# Altium project Light Sensor Prototype.PrjPcb
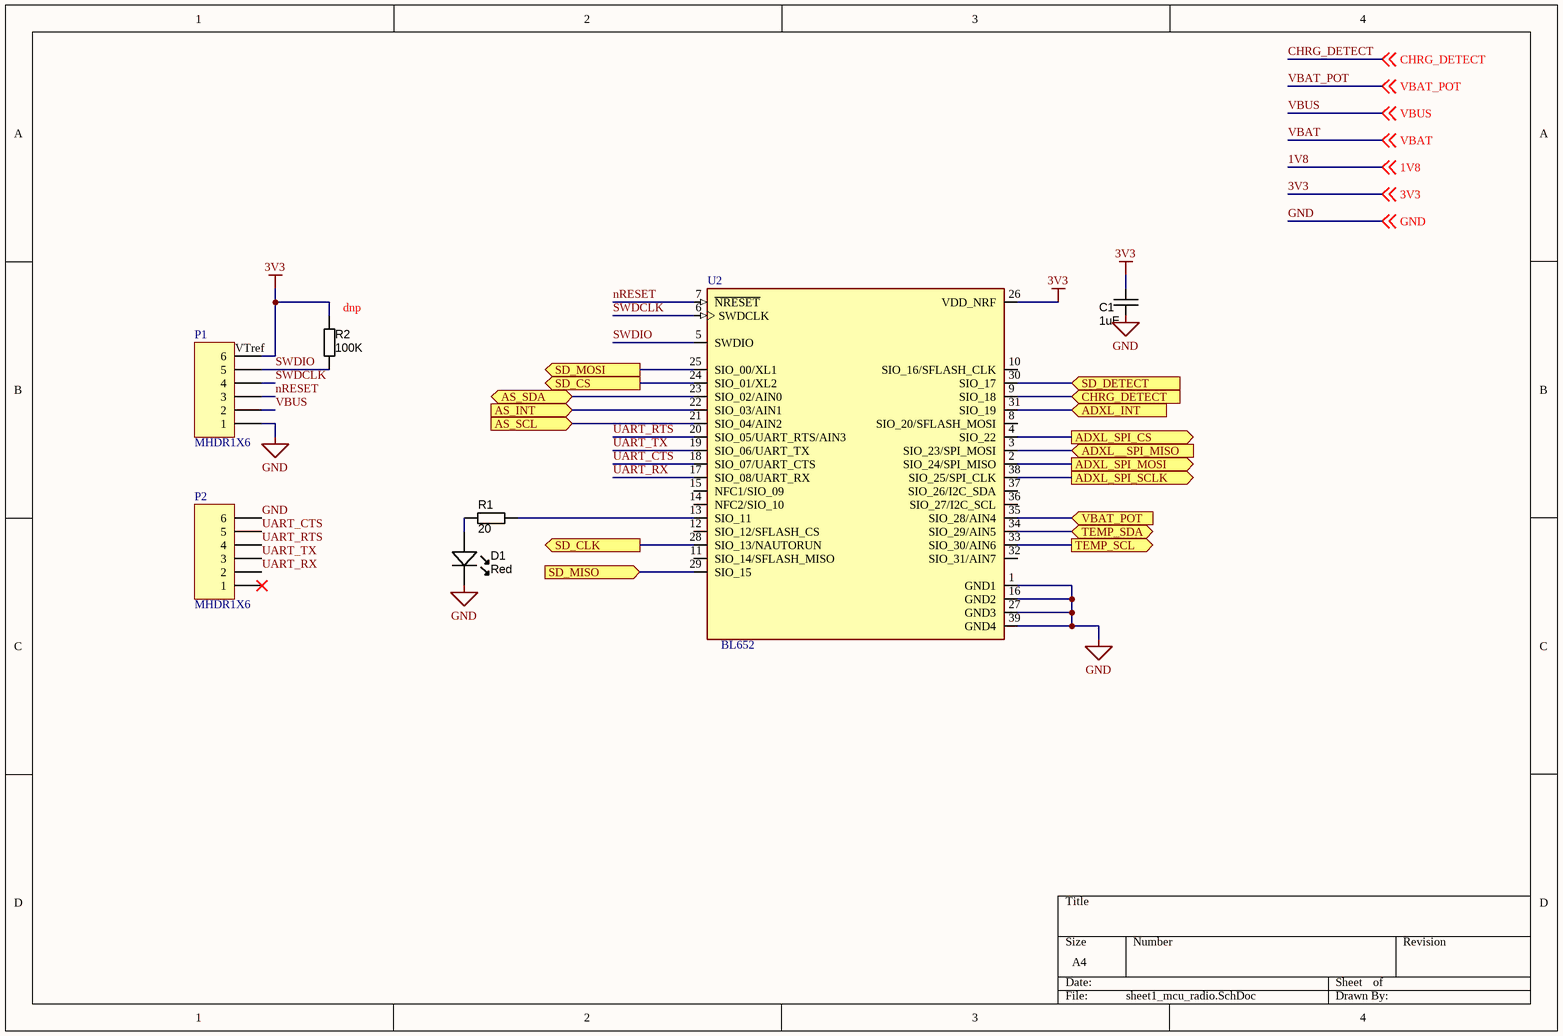
[diagram p0: sheet1_mcu_radio.SchDoc]
4 sheets, 41 parts. Net scope: flat (ports and power ports of the same name join across sheets).
Board file: Light Sensor Prototype.PcbDoc
Sheets:
  sheet1_mcu_radio.SchDoc
  sheet2_sensors.SchDoc
  sheet3_memory.SchDoc
  sheet4_power.SchDoc

## Sheet sheet1_mcu_radio.SchDoc
size A4

### Parts
C1  value 1uF  [CAPC1608X90N]  (hidden comment: approved sub OK)
D1  Red  [LED-0603-RED]
P1  MHDR1X6  [MHDR1X6]
P2  MHDR1X6  [MHDR1X6]
R1  value 20  [RESC1005X40N]  (hidden comment: Thick Film)
R2  value 100K  [RESC1005X40N]  (hidden comment: Thick Film)
U2  BL652  [BL652]

### Ports
ADXL__SPI_MISO (in), ADXL_INT (in), ADXL_SPI_CS (out), ADXL_SPI_MOSI (out), ADXL_SPI_SCLK (out), AS_INT (in), AS_SCL (in), AS_SDA (bidir), CHRG_DETECT (in), SD_CLK (out), SD_CS (out), SD_DETECT (in), SD_MISO (in), SD_MOSI (out), TEMP_SCL (out), TEMP_SDA (bidir), VBAT_POT (in)

### Nets
3V3: C1.1 P1.6 R2.1 U2.26(VDD_NRF) ; off-sheet 3V3
GND: C1.2 D1.K P1.1 P2.6 U2.1(GND1) U2.16(GND2) U2.27(GND3) U2.39(GND4) ; off-sheet GND
VBUS: P1.2 ; off-sheet VBUS
ADXL_INT: U2.31(SIO_19) ; port ADXL_INT
ADXL_SPI_CS: U2.4(SIO_22) ; port ADXL_SPI_CS
ADXL_SPI_MISO: U2.3(SIO_23/SPI_MOSI) ; port ADXL__SPI_MISO
ADXL_SPI_MOSI: U2.2(SIO_24/SPI_MISO) ; port ADXL_SPI_MOSI
ADXL_SPI_SCLK: U2.38(SIO_25/SPI_CLK) ; port ADXL_SPI_SCLK
AS_INT: U2.22(SIO_03/AIN1) ; port AS_INT
AS_SCL: U2.21(SIO_04/AIN2) ; port AS_SCL
AS_SDA: U2.23(SIO_02/AIN0) ; port AS_SDA
CHRG_DETECT: off-sheet CHRG_DETECT
nRESET: P1.3 U2.7(~{NRESET})
SD_CLK: U2.28(SIO_13/NAUTORUN) ; port SD_CLK
SD_CS: U2.24(SIO_01/XL2) ; port SD_CS
SD_DETECT: U2.30(SIO_17) ; port SD_DETECT
SD_MISO: U2.29(SIO_15) ; port SD_MISO
SD_MOSI: U2.25(SIO_00/XL1) ; port SD_MOSI
SWDCLK: P1.4 U2.6(SWDCLK)
SWDIO: P1.5 R2.2 U2.5(SWDIO)
TEMP_SCL: U2.33(SIO_30/AIN6) ; port TEMP_SCL
TEMP_SDA: U2.34(SIO_29/AIN5) ; port TEMP_SDA
UART_CTS: P2.5 U2.18(SIO_07/UART_CTS)
UART_RTS: P2.4 U2.20(SIO_05/UART_RTS/AIN3)
UART_RX: P2.2 U2.17(SIO_08/UART_RX)
UART_TX: P2.3 U2.19(SIO_06/UART_TX)
VBAT_POT: off-sheet VBAT_POT
NetC9_1: U2.35(SIO_28/AIN4) ; port VBAT_POT
NetD1_A: D1.A R1.1
NetR1_2: R1.2 U2.13(SIO_11)
NetR11_2: U2.9(SIO_18) ; port CHRG_DETECT

Not connected (* = marked no-connect by the designer): P2 1*; U2 8(SIO_20/SFLASH_MOSI) 10(SIO_16/SFLASH_CLK) 11(SIO_14/SFLASH_MISO) 12(SIO_12/SFLASH_CS) 14(NFC2/SIO_10) 15(NFC1/SIO_09) 32(SIO_31/AIN7) 36(SIO_27/I2C_SCL) 37(SIO_26/I2C_SDA)

### Notes on the sheet
- (near R2) dnp
- (near P1) VTref

### Library data of the parts
C1 = CAPC_100n_0603_X7R_50V_10%: Capacitor SMD Cer 10uF 10% 16V X5R 0603; Manufacturer: TDK; Manufacturer Part Number: C1608X5R1C106M080AB; Ratings: 16V; X5R; Material: ceramic; Package / Case: 0603 (1608 Metric); Tolerance: ±10%; Supplier: Farnell; Supplier Part Number: 2525096; Supplier Link: https://uk.farnell.com/tdk/c1608x5r1c106m080ab/cap-10-f-16v-20-x5r-0603/dp/2525096?st=2521959
D1 = LED_SMD_Red_0603_220mcd: Dialight 598-8E40-107F; Manufacturer 1: Kingbright Company LLC; Manufacturer Part Number 1: APT1608SURCK; Material: AlGaInP on GaAs; Ratings: 220 mcd; 630 nm; Voltage - Forward (Vf) Typ: 1.95V; Voltage - Forward (Vf) @ 10mA: 1.9V; SCDType: source; Package / Case: 0603 (1608 metric); Supplier 1: Digi-Key; Supplier Part Number 1: 754-1123-1-ND; ComponentLink1URL: http://www.us.kingbright.com/images/catalog/SPEC/APT1608SURCK.pdf; ComponentLink1Description: http://www.us.kingbright.com/images/catalog/SPEC/APT1608SURCK.pdf
P1 P2 = MHDR1X6: Header, 6-Pin; LatestRevisionDate: 17-Jul-2002; LatestRevisionNote: Re-released for DXP Platform.; Publisher: Altium Limited
R1 R2 = RES_100K_0402_5%: Resistor SMD chip 100k Ohm 0.063W 5% 0402; Manufacturer 1: Vishay Dale; Manufacturer Part Number 1: CRCW0402100KJNED; Ratings: 1/16 W; SCDType: undef; Package / Case: 0402 (1005 Metric); Tolerance: ±5%; ComponentLink2URL: http://www.yageo.com/documents/recent/PYu-RC0402_51_RoHS_L_6.pdf; ComponentLink2Description: http://www.yageo.com/documents/recent/PYu-RC0402_51_RoHS_L_6.pdf; Supplier 1: Digi-Key; Supplier Part Number 1: 541-100KJCT-ND; ComponentLink1URL: http://www.vishay.com/doc?20035; ComponentLink1Description: http://www.vishay.com/doc?20035; Supplier 2: Digi-Key; Supplier Part Number 2: 311-100KJRCT-ND; Manufacturer 2: Yageo; Manufacturer Part Number 2: RC0402JR-07100KL

## Sheet sheet2_sensors.SchDoc
size A4
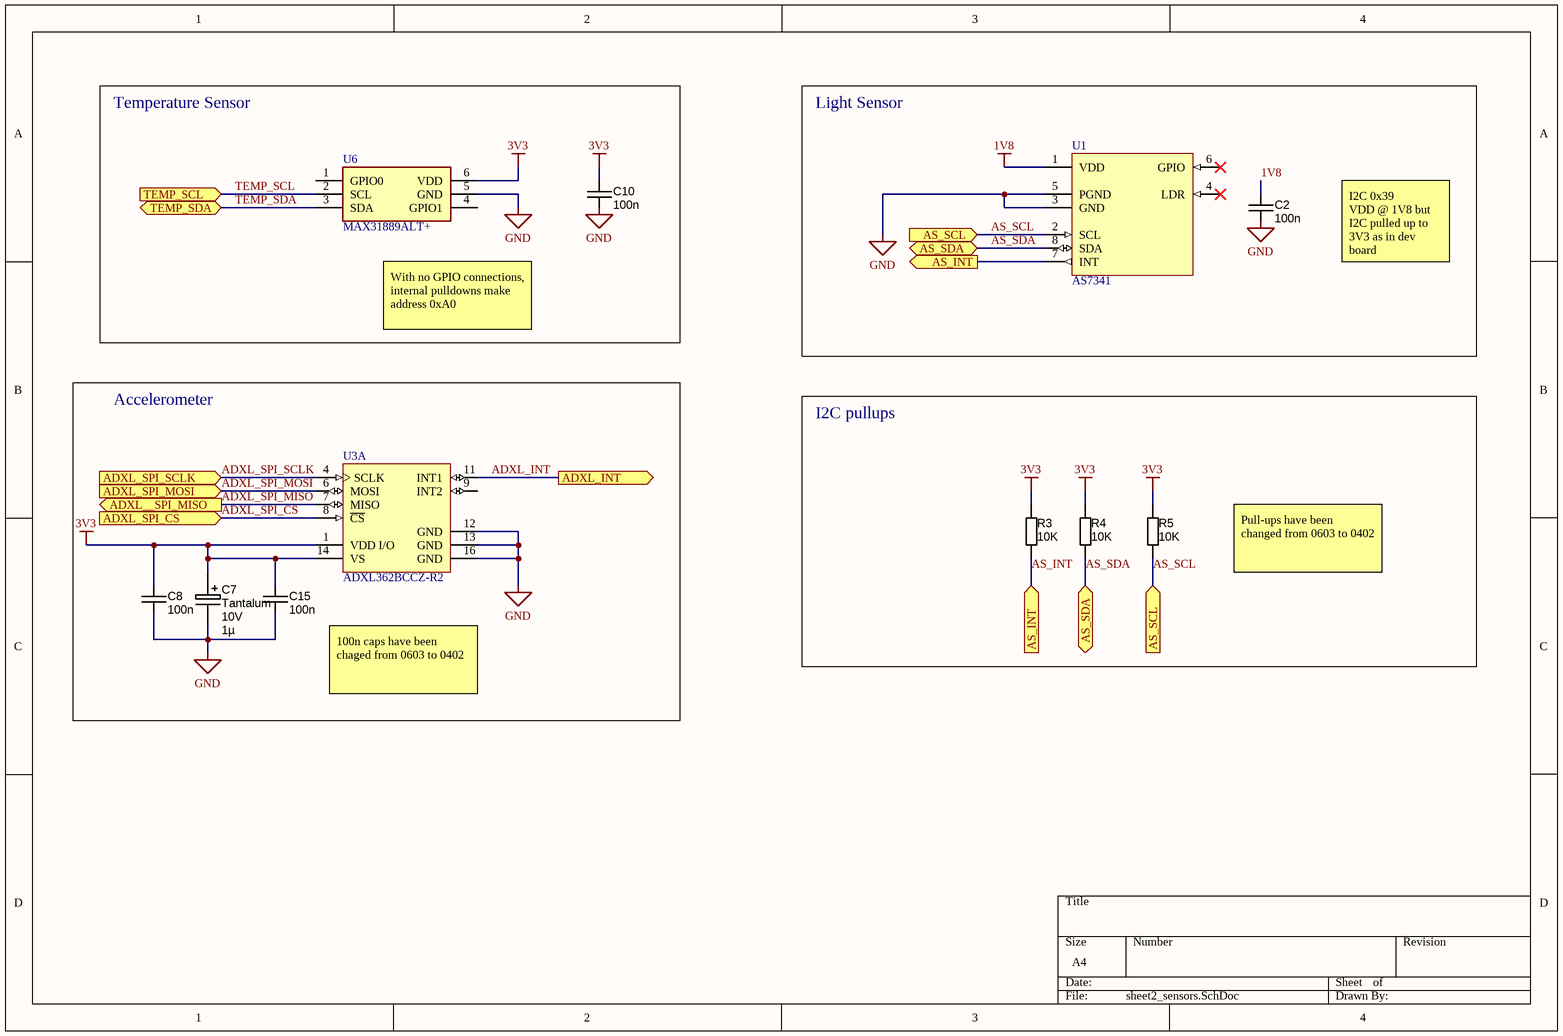
[diagram p1: sheet2_sensors.SchDoc]

### Parts
C2  100n  [CAPC1005X55N]
C7  Material: Tantalum  Ratings: 10V  [CAPMP2012X150USR]  (hidden comment: 1µ)
C8  100n  [CAPC1005X55N]
C10  100n  [CAPC1005X55N]
C15  100n  [CAPC1005X55N]
R3  value 10K  [RESC1005X40N]  (hidden comment: Thick Film)
R4  value 10K  [RESC1005X40N]  (hidden comment: Thick Film)
R5  value 10K  [RESC1005X40N]  (hidden comment: Thick Film)
U1  AS7341  [OLGA8]
U3  ADXL362BCCZ-R2  [ADI-CC-16-4_N]  (part A of 2)
U6  MAX31889ALT+  [MAX31889ALT]

### Blocks framed on the sheet
Temperature Sensor: C10 U6
Light Sensor: C2 U1
Accelerometer: C7 C8 C15 U3
I2C pullups: R3-R5

### Ports
ADXL__SPI_MISO (out), ADXL_INT (out), ADXL_SPI_CS (in), ADXL_SPI_MOSI (in), ADXL_SPI_SCLK (in), AS_INT (in), AS_INT (out), AS_SCL (in), AS_SDA (bidir), TEMP_SCL (in), TEMP_SDA (bidir)

### Nets
1V8: C2.1 U1.1(VDD)
3V3: C7.1 C8.1 C10.1 C15.1 R3.1 R4.1 R5.1 U3.1(VDD_I/O) U3.14(VS) U6.6(VDD)
GND: C2.2 C7.2 C8.2 C10.2 C15.2 U1.3(GND) U1.5(PGND) U3.12(GND) U3.13(GND) U3.16(GND) U6.5(GND)
ADXL_INT: U3.11(INT1) ; port ADXL_INT
ADXL_SPI_CS: U3.8(~{CS}) ; port ADXL_SPI_CS
ADXL_SPI_MISO: U3.7(MISO) ; port ADXL__SPI_MISO
ADXL_SPI_MOSI: U3.6(MOSI) ; port ADXL_SPI_MOSI
ADXL_SPI_SCLK: U3.4(SCLK) ; port ADXL_SPI_SCLK
AS_INT: R3.2 U1.7(INT) ; port AS_INT
AS_SCL: R5.2 U1.2(SCL) ; port AS_SCL
AS_SDA: R4.2 U1.8(SDA) ; port AS_SDA
TEMP_SCL: U6.2(SCL) ; port TEMP_SCL
TEMP_SDA: U6.3(SDA) ; port TEMP_SDA

Not connected (* = marked no-connect by the designer): U1 4(LDR)* 6(GPIO)*; U3 9(INT2); U6 1(GPIO0) 4(GPIO1)

### Notes on the sheet
- I2C 0x39
  VDD @ 1V8 but I2C pulled up to 3V3 as in dev board
- With no GPIO connections, internal pulldowns make address 0xA0
- Pull-ups have been changed from 0603 to 0402
- 100n caps have been chaged from 0603 to 0402

### Library data of the parts
C2 C8 C10 C15 = CAPC_100n_0402_X5R_16V_10%: Capacitor SMD Cer 100nF 10% 16V X5R 0402; Manufacturer 1: AVX Corporation; Manufacturer Part Number 1: 0402YD104KAT2A; Ratings: 16V; X5R; SCDType: spec; Tolerance: ±10%; Operating Temperature: -55°C ~ 125°C; Package / Case: 0402 (1005 Metric); Size / Dimension: 0.039" L x 0.020" W (1.00mm x 0.50mm); Supplier 1: Digi-Key; Supplier Part Number 1: 478-1126-1-ND; ComponentLink1URL: http://www.avx.com/docs/Catalogs/cx5r.pdf; ComponentLink1Description: http://www.avx.com/docs/Catalogs/cx5r.pdf; Supplier 2: Digi-Key; Supplier Part Number 2: 311-1347-1-ND; Manufacturer 2: Yageo; Manufacturer Part Number 2: CC0402KRX5R7BB104; ComponentLink2URL: http://www.yageo.com/documents/recent/UPY-GPHC_X5R_4V-to-50V_12.pdf; ComponentLink2Description: http://www.yageo.com/documents/recent/UPY-GPHC_X5R_4V-to-50V_12.pdf; Value: 100n
C7 = CAPT_1u_0805_10V: Capacitor SMD Tantalum 1uF 20% 10V 0805; Manufacturer 1: AVX Corporation; Manufacturer Part Number 1: TAJP106M010RNJ; Manufacturer Size Code: P; ESR (Equivalent Series Resistance): 6.000 Ohm; Type: Molded; SCDType: spec; Package / Case: 0805 (2012 metric); Tolerance: ±20%; Supplier 1: Digi-Key; Supplier Part Number 1: 478-3281-1-ND; Operating Temperature: -55°C ~ 125°C; Size / Dimension: 0.081" L x 0.053" W (2.05mm x 1.35mm); Height - Seated (Max): 0.059" (1.50mm); ComponentLink1URL: http://www.avx.com/docs/Catalogs/tajlp.pdf; ComponentLink1Description: http://www.avx.com/docs/Catalogs/tajlp.pdf; Value: 1µ
R3-R5 = RES_10K_0402_5%: Resistor SMD chip 10k Ohm 0.063W 5% 0402; Manufacturer 1: Vishay Dale; Manufacturer Part Number 1: CRCW040210K0FKED; Ratings: 1/16 W; SCDType: undef; Package / Case: 0402 (1005 Metric); Tolerance: ±5%; Manufacturer 2: Yageo; Manufacturer Part Number 2: RC0402JR-0710KL; Supplier 1: Digi-Key; Supplier Part Number 1: 541-10.0KLCT-ND; ComponentLink1URL: http://www.vishay.com/doc?20035; ComponentLink1Description: http://www.vishay.com/doc?20035; Supplier 2: Digi-Key; Supplier Part Number 2: 311-10KJRCT-ND; ComponentLink2URL: http://www.yageo.com/documents/recent/PYu-RC0402_51_RoHS_L_6.pdf; ComponentLink2Description: http://www.yageo.com/documents/recent/PYu-RC0402_51_RoHS_L_6.pdf
U1 = AS7341: AMS AS7341 / 11-Channel Spectral Sensor Frontend
U3 = ADXL362BCCZ-R2: Micropower, 3-Axis, +/-2 g / +/-4 g / +/-8 g Digital Output MEMS Accelerometer with 200 Hz BW, Industrial, 16-pin LGA, Reel; Manufacturer: Analog Devices; # of Axes: 3; -3dB Bandwidth: 200 Hz; Sensitivity: 1/2/4 mg/LSB; Supply Current: 1.8 uA; Voltage Supply (V): 1.6 to 3.5; DatasheetVersion: Rev. B; PackageVersion: 10-23-2012-A, 10/2012; PackageReference: CC-16-4; PackageDescription: 16-Pin Land Grid Array, 3.25 x 3 mm Body, 0.5 mm Pitch; Supplier 1: Digi-Key; Supplier Part Number 1: ADXL362BCCZ-R2TR-ND; Supplier 2: Digi-Key; Supplier Part Number 2: ADXL362BCCZ-R2CT-ND; Supplier 3: Digi-Key; Supplier Part Number 3: ADXL362BCCZ-R2DKR-ND; Supplier 4: Newark; Supplier Part Number 4: 45W7058; Supplier 5: Mouser; Supplier Part Number 5: 584-ADXL362BCCZ-R2; Output Type: Digital; Packing: Reel; Mounting Technology: Surface Mount; PartNumber: ADXL362BCCZ-R2; ComponentLink1Description: Manufacturer URL; ComponentLink1URL: http://www.analog.com/en/index.html; ComponentLink2Description: Datasheet; ComponentLink2URL: http://www.analog.com/static/imported-files/data_sheets/ADXL362.pdf; ComponentLink3Description: Package Specification; ComponentLink3URL: http:/www.analog.com/static/imported-files/packages/PKG_PDF/LGA(CC)/CC_16_4.pdf; ComponentLink4Description: Product URL; ComponentLink4URL: http://www.analog.com/en/mems-sensors/mems-inertial-sensors/adxl362/products/product.html
U6 = MAX31889ALT+: Integrated Circuit; Manufacturer_Name: Maxim Integrated; Datasheet Link: https://pdfserv.maximintegrated.com/en/ds/MAX31889.pdf; Height: 0.8mm; Manufacturer_Part_Number: MAX31889ALT+

## Sheet sheet3_memory.SchDoc
size A4
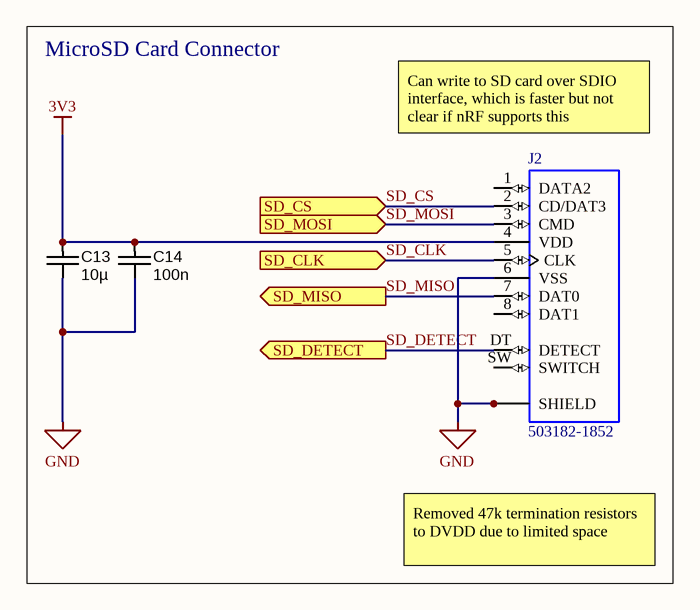
[diagram p2: sheet3_memory.SchDoc]

### Parts
C13  value 10µ  [CAPC2012X135N]  (hidden comment: approved sub OK)
C14  100n  [CAPC1005X55N]
J2  503182-1852  [MOLEX_503182-1852]

### Blocks framed on the sheet
MicroSD Card Connector: C13 C14 J2

### Ports
SD_CLK (in), SD_CS (in), SD_DETECT (out), SD_MISO (out), SD_MOSI (in)

### Nets
3V3: C13.1 C14.1 J2.4(VDD)
GND: C13.2 C14.2 J2.6(VSS) J2.P1(SHIELD) J2.P2(SHIELD) J2.P3(SHIELD) J2.P4(SHIELD) J2.P5(SHIELD)
SD_CLK: J2.5(CLK) ; port SD_CLK
SD_CS: J2.2(CD/DAT3) ; port SD_CS
SD_DETECT: J2.DT(DETECT) ; port SD_DETECT
SD_MISO: J2.7(DAT0) ; port SD_MISO
SD_MOSI: J2.3(CMD) ; port SD_MOSI

Not connected (* = marked no-connect by the designer): J2 1(DATA2) 8(DAT1) SW(SWITCH)

### Notes on the sheet
- (near J2) Can write to SD card over SDIO interface, which is faster but not clear if nRF supports this
- Removed 47k termination resistors to DVDD due to limited space

### Library data of the parts
C13 = CAPC_10u_0805_10V: Capacitor SMD Cer 10uF 10% 10V X5R 0805; Manufacturer 1: AVX Corporation; Manufacturer Part Number 1: 0805ZD106KAT2A; Ratings: 10V; X5R; Material: ceramic; SCDType: spec; Package / Case: 0805 (2012 metric); Tolerance: ±10%; Manufacturer 2: Kemet; Manufacturer Part Number 2: C0805C106K8PACTU; Supplier 1: Digi-Key; Supplier Part Number 1: 478-5167-1-ND; ComponentLink1URL: http://www.avx.com/docs/Catalogs/cx5r.pdf; ComponentLink1Description: http://www.avx.com/docs/Catalogs/cx5r.pdf; ComponentLink2URL: http://www.kemet.com/datasheets&C0805C106K8PACTU; ComponentLink2Description: http://www.kemet.com/datasheets&C0805C106K8PACTU; Supplier 2: Digi-Key; Supplier Part Number 2: 399-4925-1-ND
C14 = CAPC_100n_0402_X5R_16V_10%: as C2 on sheet sheet2_sensors; Tolerance: ±10%; Operating Temperature: -55°C ~ 125°C; Package / Case: 0402 (1005 Metric); Size / Dimension: 0.039" L x 0.020" W (1.00mm x 0.50mm); Supplier 1: Digi-Key; Supplier Part Number 1: 478-1126-1-ND; ComponentLink1URL: http://www.avx.com/docs/Catalogs/cx5r.pdf; ComponentLink1Description: http://www.avx.com/docs/Catalogs/cx5r.pdf; Supplier 2: Digi-Key; Supplier Part Number 2: 311-1347-1-ND; Manufacturer 2: Yageo; Manufacturer Part Number 2: CC0402KRX5R7BB104; ComponentLink2URL: http://www.yageo.com/documents/recent/UPY-GPHC_X5R_4V-to-50V_12.pdf; ComponentLink2Description: http://www.yageo.com/documents/recent/UPY-GPHC_X5R_4V-to-50V_12.pdf; Value: 100n
J2 = 503182-1852: 10 _8 + 2_ Position Card Connector microSDâ„¢ Surface Mount, Right Angle Gold; MF: Molex; MP: 5031821852; Digi-Key_Part_Number: WM12834CT-ND; Digi-Key_Purchase_URL: https://www.digikey.com.tr/product-detail/en/molex/5031821852/WM12834CT-ND/5823232?utm_source=snapeda&utm_medium=aggregator&utm_campaign=symbol; SnapEDA_Link: https://www.snapeda.com/parts/5031821852/Molex/view-part/46835/?ref=snap; Value: *; Package: None

## Sheet sheet4_power.SchDoc
size A4
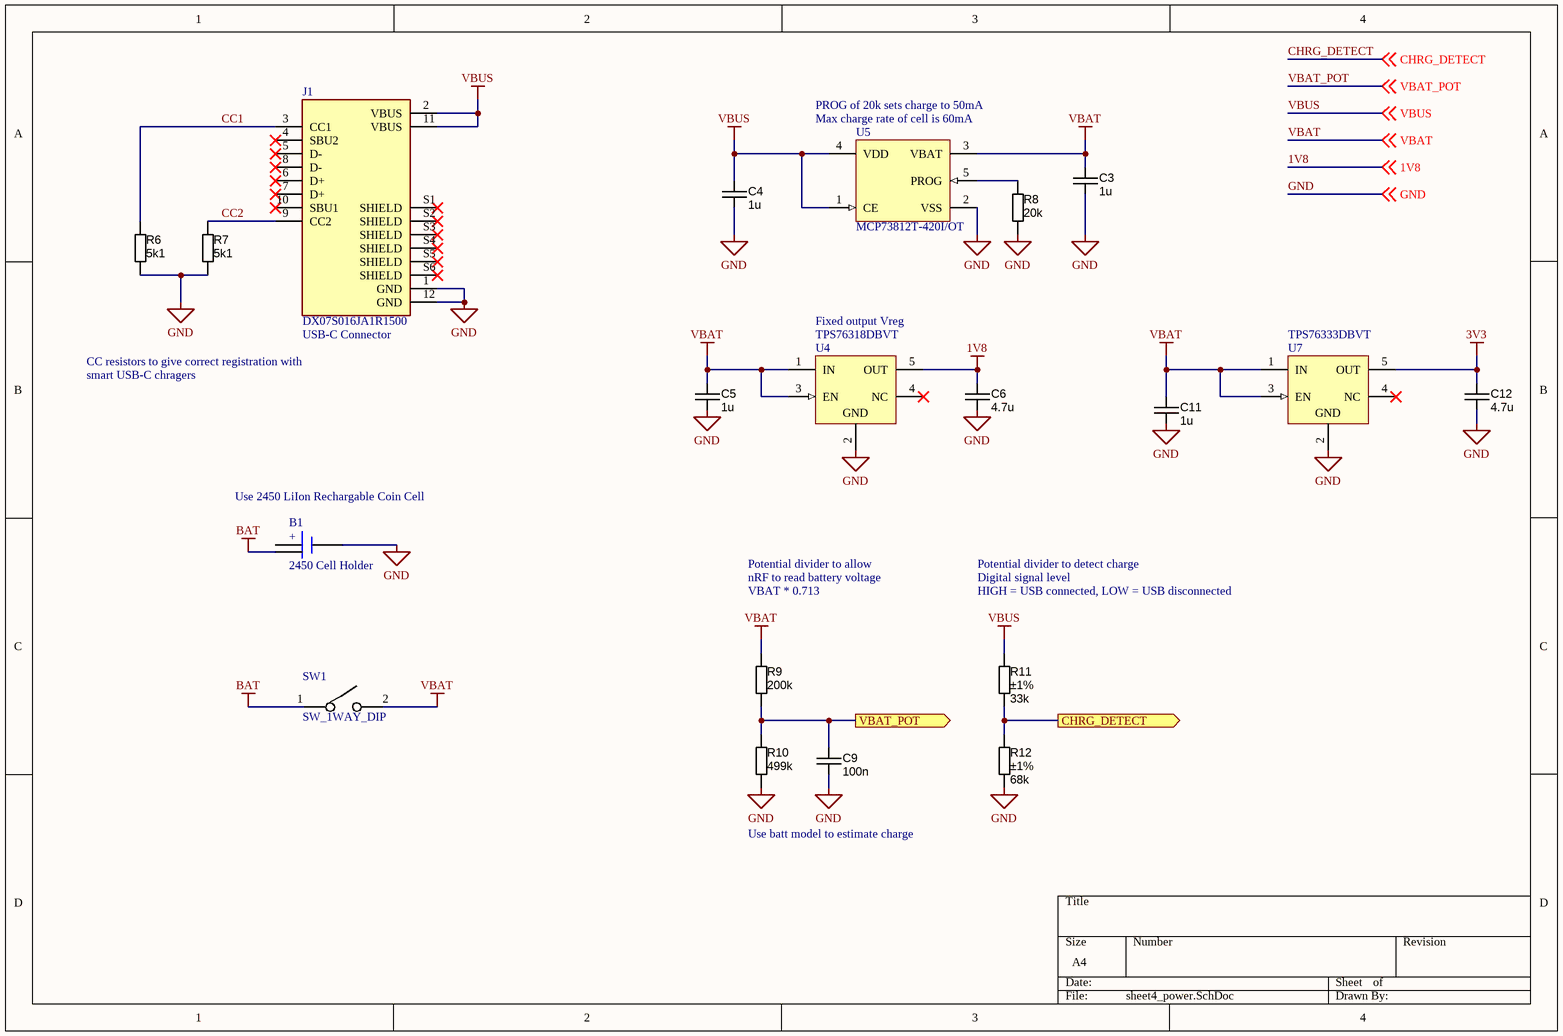
[diagram p3: sheet4_power.SchDoc]

### Parts
B1  2450 Cell Holder  [BC-2404]
C3  1u  [CAPC1005X55N]
C4  1u  [CAPC1005X55N]
C5  1u  [CAPC1005X55N]
C6  4.7u  [CAPC1005X55N]
C9  100n  [CAPC1005X55N]
C11  1u  [CAPC1005X55N]
C12  4.7u  [CAPC1005X55N]
J1  DX07S016JA1R1500  [JAE_DX07S016JA1R1500]
R6  value 5k1  [RESC1005X40N]  (hidden comment: Thick Film)
R7  value 5k1  [RESC1005X40N]  (hidden comment: Thick Film)
R8  value 20k  [RESC1005X40N]  (hidden comment: Thick Film)
R9  value 200k  [RESC1005X40N]  (hidden comment: Thick Film)
R10  value 499k  [RESC1005X40N]  (hidden comment: Thick Film)
R11  value 33k  Tolerance: ±1%  [RESC1608X55N]  (hidden comment: Thick Film)
R12  value 68k  Tolerance: ±1%  [RESC1608X55N]  (hidden comment: Thick Film)
SW1  SW_1WAY_DIP  [SW_1WAY]
U4  TPS76318DBVT  [TI-DBV5_N]
U5  MCP73812T-420I/OT  [SOT-23-OT5_N]
U7  TPS76333DBVT  [TI-DBV5_N]

### Ports
CHRG_DETECT (out), VBAT_POT (out)

### Nets
1V8: C6.1 U4.5(OUT) ; off-sheet 1V8
3V3: C12.1 U7.5(OUT)
BAT: B1.3(+) SW1.1
GND: B1.2(-) C3.2 C4.2 C5.2 C6.2 C9.2 C11.2 C12.2 J1.1(GND) J1.12(GND) R6.2 R7.2 R8.2 R10.2 R12.2 U4.2(GND) U5.2(VSS) U7.2(GND) ; off-sheet GND
VBAT: C3.1 C5.1 C11.1 R9.1 SW1.2 U4.1(IN) U4.3(EN) U5.3(VBAT) U7.1(IN) U7.3(EN) ; off-sheet VBAT
VBUS: C4.1 J1.2(VBUS) J1.11(VBUS) R11.1 U5.1(CE) U5.4(VDD) ; off-sheet VBUS
CC1: J1.3(CC1) R6.1
CC2: J1.9(CC2) R7.1
CHRG_DETECT: off-sheet CHRG_DETECT
VBAT_POT: off-sheet VBAT_POT
NetC9_1: C9.1 R9.2 R10.1 ; port VBAT_POT
NetR8_1: R8.1 U5.5(PROG)
NetR11_2: R11.2 R12.1 ; port CHRG_DETECT

Not connected (* = marked no-connect by the designer): B1 1(+); J1 4(SBU2)* 5(D-)* 6(D+)* 7(D+)* 8(D-)* 10(SBU1)* S1(SHIELD)* S2(SHIELD)* S3(SHIELD)* S4(SHIELD)* S5(SHIELD)* S6(SHIELD)*; U4 4(NC)*; U7 4(NC)*

### Notes on the sheet
- (near U5) PROG of 20k sets charge to 50mA
- (near U5) Max charge rate of cell is 60mA
- CC resistors to give correct registration with
- smart USB-C chragers
- (near J1) USB-C Connector
- (near U4) Fixed output Vreg
- (near B1) Use 2450 LiIon Rechargable Coin Cell
- Potential divider to allow
- nRF to read battery voltage
- Potential divider to detect charge
- Digital signal level
- VBAT * 0.713
- HIGH = USB connected, LOW = USB disconnected
- Use batt model to estimate charge

### Library data of the parts
B1 = 2450-LiIon: Multicomp BC-2404
C3-C5 C11 = CAPC_100n_0402_X5R_16V_10%: Capacitor SMD Cer 1uF 10% 16V X5R 0402; Manufacturer 1: AVX Corporation; Manufacturer Part Number 1: 0402YD104KAT2A; Ratings: 16V; X5R; SCDType: spec; Tolerance: ±10%; Operating Temperature: -55°C ~ 125°C; Package / Case: 0402 (1005 Metric); Size / Dimension: 0.039" L x 0.020" W (1.00mm x 0.50mm); Supplier 1: Digi-Key; Supplier Part Number 1: 478-1126-1-ND; ComponentLink1URL: http://www.avx.com/docs/Catalogs/cx5r.pdf; ComponentLink1Description: http://www.avx.com/docs/Catalogs/cx5r.pdf; Supplier 2: Digi-Key; Supplier Part Number 2: 311-1347-1-ND; Manufacturer 2: Yageo; Manufacturer Part Number 2: CC0402KRX5R7BB104; ComponentLink2URL: http://www.yageo.com/documents/recent/UPY-GPHC_X5R_4V-to-50V_12.pdf; ComponentLink2Description: http://www.yageo.com/documents/recent/UPY-GPHC_X5R_4V-to-50V_12.pdf; Value: 1u
C6 C12 = CAPC_100n_0402_X5R_16V_10%: Capacitor SMD Cer 4.7uF 10% 16V X5R 0402; Manufacturer 1: AVX Corporation; Manufacturer Part Number 1: 0402YD104KAT2A; Ratings: 16V; X5R; SCDType: spec; Tolerance: ±10%; Operating Temperature: -55°C ~ 125°C; Package / Case: 0402 (1005 Metric); Size / Dimension: 0.039" L x 0.020" W (1.00mm x 0.50mm); Supplier 1: Digi-Key; Supplier Part Number 1: 478-1126-1-ND; ComponentLink1URL: http://www.avx.com/docs/Catalogs/cx5r.pdf; ComponentLink1Description: http://www.avx.com/docs/Catalogs/cx5r.pdf; Supplier 2: Digi-Key; Supplier Part Number 2: 311-1347-1-ND; Manufacturer 2: Yageo; Manufacturer Part Number 2: CC0402KRX5R7BB104; ComponentLink2URL: http://www.yageo.com/documents/recent/UPY-GPHC_X5R_4V-to-50V_12.pdf; ComponentLink2Description: http://www.yageo.com/documents/recent/UPY-GPHC_X5R_4V-to-50V_12.pdf; Value: 4.7u
C9 = CAPC_100n_0402_X5R_16V_10%: as C2 on sheet sheet2_sensors; Tolerance: ±10%; Operating Temperature: -55°C ~ 125°C; Package / Case: 0402 (1005 Metric); Size / Dimension: 0.039" L x 0.020" W (1.00mm x 0.50mm); Supplier 1: Digi-Key; Supplier Part Number 1: 478-1126-1-ND; ComponentLink1URL: http://www.avx.com/docs/Catalogs/cx5r.pdf; ComponentLink1Description: http://www.avx.com/docs/Catalogs/cx5r.pdf; Supplier 2: Digi-Key; Supplier Part Number 2: 311-1347-1-ND; Manufacturer 2: Yageo; Manufacturer Part Number 2: CC0402KRX5R7BB104; ComponentLink2URL: http://www.yageo.com/documents/recent/UPY-GPHC_X5R_4V-to-50V_12.pdf; ComponentLink2Description: http://www.yageo.com/documents/recent/UPY-GPHC_X5R_4V-to-50V_12.pdf; Value: 100n
J1 = DX07S016JA1R1500: USB-C (USB TYPE-C) USB 2.0 Receptacle Connector 24 (16+8 Dummy) Position Surface Mount, Right Angle; Through Hole; MF: JAE Electronics; Value: *; Price: None; Package: None; Availability: Unavailable; MP: DX07S016JA1R1500; DigiKey-Purchase-URL: https://snapeda.com/shop?store=DigiKey&id=4551013; SnapEDA_Link: https://www.snapeda.com/parts/DX07S016JA1R1500/JAE%20Electronics/view-part/4551013/?ref=snap
R6 R7 = RES_3K3_0402_5%: Resistor SMD chip 5.1k Ohm 0.063W 5% 0402; Manufacturer 1: Yageo; Manufacturer Part Number 1: RC0402JR-073K3L; Ratings: 1/16 W; SCDType: spec; Package / Case: 0402 (1005 metric); Tolerance: ±5%; Material: Thick Film; Supplier 1: Digi-Key; Supplier Part Number 1: 311-3.3KJRCT-ND; ComponentLink1URL: http://www.yageo.com/documents/recent/PYu-RC0402_51_RoHS_L_6.pdf; ComponentLink1Description: http://www.yageo.com/documents/recent/PYu-RC0402_51_RoHS_L_6.pdf
R8 = RES_3K3_0402_5%: Resistor SMD chip 20k Ohm 0.063W 5% 0402; Manufacturer 1: Yageo; Manufacturer Part Number 1: RC0402JR-073K3L; Ratings: 1/16 W; SCDType: spec; Package / Case: 0402 (1005 metric); Tolerance: ±5%; Material: Thick Film; Supplier 1: Digi-Key; Supplier Part Number 1: 311-3.3KJRCT-ND; ComponentLink1URL: http://www.yageo.com/documents/recent/PYu-RC0402_51_RoHS_L_6.pdf; ComponentLink1Description: http://www.yageo.com/documents/recent/PYu-RC0402_51_RoHS_L_6.pdf
R9 = RES_3K3_0402_5%: Resistor SMD chip 2.4 MOhm 0.063W 5% 0402; Manufacturer 1: Yageo; Manufacturer Part Number 1: RC0402JR-073K3L; Ratings: 1/16 W; SCDType: spec; Package / Case: 0402 (1005 metric); Tolerance: ±5%; Material: Thick Film; Supplier 1: Digi-Key; Supplier Part Number 1: 311-3.3KJRCT-ND; ComponentLink1URL: http://www.yageo.com/documents/recent/PYu-RC0402_51_RoHS_L_6.pdf; ComponentLink1Description: http://www.yageo.com/documents/recent/PYu-RC0402_51_RoHS_L_6.pdf
R10 = RES_3K3_0402_5%: Resistor SMD chip 7.5 MOhm 0.063W 5% 0402; Manufacturer 1: Yageo; Manufacturer Part Number 1: RC0402JR-073K3L; Ratings: 1/16 W; SCDType: spec; Package / Case: 0402 (1005 metric); Tolerance: ±5%; Material: Thick Film; Supplier 1: Digi-Key; Supplier Part Number 1: 311-3.3KJRCT-ND; ComponentLink1URL: http://www.yageo.com/documents/recent/PYu-RC0402_51_RoHS_L_6.pdf; ComponentLink1Description: http://www.yageo.com/documents/recent/PYu-RC0402_51_RoHS_L_6.pdf
R11 = RES_10K_0603_1%: Resistor SMD chip 33k Ohm 0.1W 1% 0603; Manufacturer 1: Yageo; Manufacturer Part Number 1: RC0603FR-0710KL; Ratings: 1/10W; SCDType: spec; Package / Case: 0603 (1608 Metric); Supplier 1: Digi-Key; Supplier Part Number 1: 311-10.0KHRCT-ND
R12 = RES_10K_0603_1%: Resistor SMD chip 68k Ohm 0.1W 1% 0603; Manufacturer 1: Yageo; Manufacturer Part Number 1: RC0603FR-0710KL; Ratings: 1/10W; SCDType: spec; Package / Case: 0603 (1608 Metric); Supplier 1: Digi-Key; Supplier Part Number 1: 311-10.0KHRCT-ND
U4 = TPS76318DBVT: Single Output LDO, 150 mA, Fixed 1.8 V Output, 2.7 to 10 V Input, with Low IQ, 5-pin SOT-23 (DBV), -40 to 125 degC, Green (RoHS & no Sb/Br); Manufacturer: Texas Instruments; Accuracy(%): 3; Fixed Output Options(V): 1.8; Iout(Max)(A): 0.15; Iq(Typ)(mA): 0.08; SubFamily: Single Channel LDO; Vdo(Typ)(mV): 300; Vin(Max)(V): 10; Vin(Min)(V): 2.7; DatasheetVersion: SLVS181H; PackageVersion: 4073253-4/K; PackageReference: DBV5; PackageDescription: 5-Pin Plastic Small Outline, Body 1.60 Ã— 2.90 mm, Pitch 0.95 mm; Supplier 1: Digi-Key; Supplier Part Number 1: 296-2700-2-ND; Supplier 2: Digi-Key; Supplier Part Number 2: 296-2700-1-ND; Supplier 3: Digi-Key; Supplier Part Number 3: 296-2700-6-ND; Supplier 4: Farnell; Supplier Part Number 4: 8461341RL; Supplier 5: Farnell; Supplier Part Number 5: 8461341; Supplier 6: Newark; Supplier Part Number 6: 96C8608; Supplier 7: Mouser; Supplier Part Number 7: 595-TPS76318DBVT; Eco-Plan: Green (RoHS & no Sb/Br); Vout Adj(Max)(V): 1.8; Vout Adj(Min)(V): 1.8; Mounting Technology: Surface Mount; Code_JEDEC: MO-178; PartNumber: TPS76318DBVT; ComponentLink1Description: Manufacturer URL; ComponentLink1URL: http://www.ti.com/; ComponentLink2Description: Datasheet; ComponentLink2URL: http://www.ti.com/general/docs/lit/getliterature.tsp?genericPartNumber=TPS76318&fileType=pdf; ComponentLink3Description: Package Specification; ComponentLink3URL: http://www.ti.com/litv/pdf/mpds018i
U5 = MCP73812T-420I/OT: Simple, Miniature Single-Cell, Fully Integrated Li-Ion/Li-Polymer Charge Management Controller, 4.2V, 5-Pin SOT-23, Industrial Temperature, Tape and Reel; Manufacturer: Microchip; DatasheetVersion: revB, Sep-2007; PackageVersion: revBB, Aug-2009; PackageReference: SOT-23-OT5; PackageDescription: 5-Lead Plastic Small Outline Transistor (OT) [SOT-23]; Supplier 1: Digi-Key; Supplier Part Number 1: MCP73812T-420I/OTTR-ND; Supplier 2: Digi-Key; Supplier Part Number 2: MCP73812T-420I/OTCT-ND; Supplier 3: Digi-Key; Supplier Part Number 3: MCP73812T-420I/OTDKR-ND; Supplier 4: Farnell; Supplier Part Number 4: 1627187RL; Supplier 5: Farnell; Supplier Part Number 5: 1627187; Supplier 6: Newark; Supplier Part Number 6: 27M0232; Mounting Technology: Surface Mount; Code_IPC: SOT23-5; PartNumber: MCP73812T-420I/OT; ComponentLink1Description: Manufacturer URL; ComponentLink1URL: http://www.microchip.com/; ComponentLink2Description: Datasheet; ComponentLink2URL: http://ww1.microchip.com/downloads/en/DeviceDoc/22036b.pdf; ComponentLink3Description: Package Specification; ComponentLink3URL: http://www.microchip.com/stellent/groups/techpub_sg/documents/packagingspec/en012702.pdf; Supplier 7: Mouser; Supplier Part Number 7: 579-MCP73812T-420IOT
U7 = TPS76333DBVT: Single Output LDO, 150 mA, Fixed 3.3 V Output, 2.7 to 10 V Input, with Low IQ, 5-pin SOT-23 (DBV), -40 to 125 degC, Green (RoHS & no Sb/Br); Manufacturer: Texas Instruments; Accuracy(%): 3; Fixed Output Options(V): 3.3; Iout(Max)(A): 0.15; Iq(Typ)(mA): 0.08; SubFamily: Single Channel LDO; Vdo(Typ)(mV): 300; Vin(Max)(V): 10; Vin(Min)(V): 2.7; DatasheetVersion: SLVS181H; PackageVersion: 4073253-4/K; PackageReference: DBV5; PackageDescription: 5-Pin Plastic Small Outline, Body 1.60 Ã— 2.90 mm, Pitch 0.95 mm; Supplier 1: Digi-Key; Supplier Part Number 1: 296-2705-2-ND; Supplier 2: Digi-Key; Supplier Part Number 2: 296-2705-1-ND; Supplier 3: Digi-Key; Supplier Part Number 3: 296-2705-6-ND; Supplier 4: Farnell; Supplier Part Number 4: 8461376; Supplier 5: Farnell; Supplier Part Number 5: 8461376RL; Supplier 6: Newark; Supplier Part Number 6: 96C8605; Supplier 7: Mouser; Supplier Part Number 7: 595-TPS76333DBVT; Eco-Plan: Green (RoHS & no Sb/Br); Vout Adj(Max)(V): 3.3; Vout Adj(Min)(V): 3.3; Mounting Technology: Surface Mount; Code_JEDEC: MO-178; PartNumber: TPS76333DBVT; ComponentLink1Description: Manufacturer URL; ComponentLink1URL: http://www.ti.com/; ComponentLink2Description: Datasheet; ComponentLink2URL: http://www.ti.com/general/docs/lit/getliterature.tsp?genericPartNumber=TPS76333&fileType=pdf; ComponentLink3Description: Package Specification; ComponentLink3URL: http://www.ti.com/litv/pdf/mpds018i

## Nets that join several sheets
1V8: sheet2_sensors (C2.1 U1.1), sheet4_power (C6.1 U4.5)
3V3: sheet1_mcu_radio (C1.1 P1.6 R2.1 U2.26), sheet2_sensors (10 pins), sheet3_memory (C13.1 C14.1 J2.4), sheet4_power (C12.1 U7.5)
GND: sheet1_mcu_radio (8 pins), sheet2_sensors (11 pins), sheet3_memory (8 pins), sheet4_power (18 pins)
VBUS: sheet1_mcu_radio (P1.2), sheet4_power (6 pins)
ADXL_INT: sheet1_mcu_radio (U2.31), sheet2_sensors (U3.11)
ADXL_SPI_CS: sheet1_mcu_radio (U2.4), sheet2_sensors (U3.8)
ADXL_SPI_MISO: sheet1_mcu_radio (U2.3), sheet2_sensors (U3.7)
ADXL_SPI_MOSI: sheet1_mcu_radio (U2.2), sheet2_sensors (U3.6)
ADXL_SPI_SCLK: sheet1_mcu_radio (U2.38), sheet2_sensors (U3.4)
AS_INT: sheet1_mcu_radio (U2.22), sheet2_sensors (R3.2 U1.7)
AS_SCL: sheet1_mcu_radio (U2.21), sheet2_sensors (R5.2 U1.2)
AS_SDA: sheet1_mcu_radio (U2.23), sheet2_sensors (R4.2 U1.8)
NetC9_1: sheet1_mcu_radio (U2.35), sheet4_power (C9.1 R9.2 R10.1)
NetR11_2: sheet1_mcu_radio (U2.9), sheet4_power (R11.2 R12.1)
SD_CLK: sheet1_mcu_radio (U2.28), sheet3_memory (J2.5)
SD_CS: sheet1_mcu_radio (U2.24), sheet3_memory (J2.2)
SD_DETECT: sheet1_mcu_radio (U2.30), sheet3_memory (J2.DT)
SD_MISO: sheet1_mcu_radio (U2.29), sheet3_memory (J2.7)
SD_MOSI: sheet1_mcu_radio (U2.25), sheet3_memory (J2.3)
TEMP_SCL: sheet1_mcu_radio (U2.33), sheet2_sensors (U6.2)
TEMP_SDA: sheet1_mcu_radio (U2.34), sheet2_sensors (U6.3)